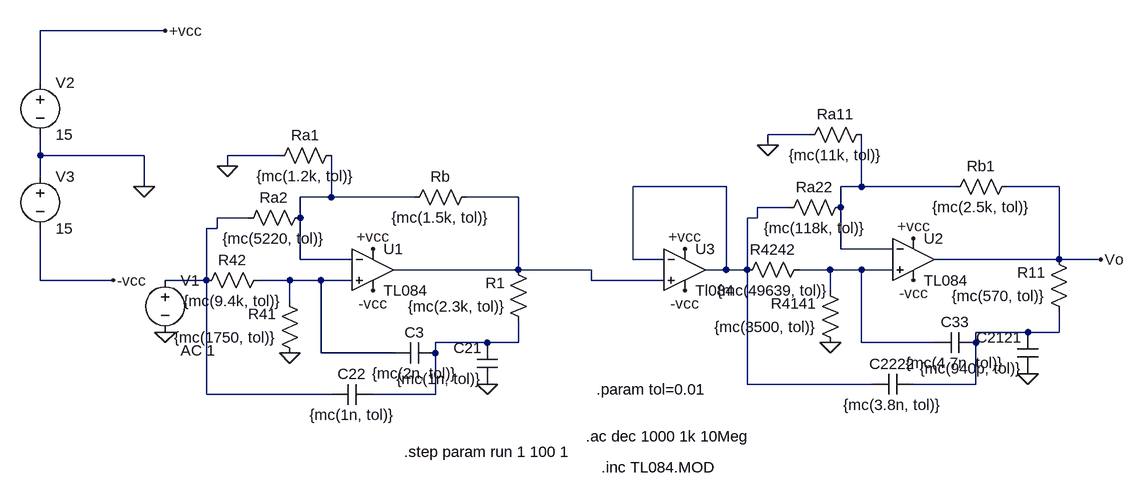
[diagram p0: schematic simIntento1.asc]
simIntento1.asc, the LTspice schematic file:
Version 4
SHEET 1 1392 680
WIRE -96 -208 -288 -208
WIRE -288 -128 -288 -208
WIRE 896 -48 832 -48
WIRE 832 -32 832 -48
WIRE -288 -16 -288 -48
WIRE -128 -16 -288 -16
WIRE 80 -16 0 -16
WIRE 0 0 0 -16
WIRE -288 16 -288 -16
WIRE -128 32 -128 -16
WIRE 768 32 624 32
WIRE 976 32 976 -48
WIRE 976 32 944 32
WIRE 1120 32 976 32
WIRE 1280 32 1200 32
WIRE 160 48 160 -16
WIRE 160 48 112 48
WIRE 288 48 160 48
WIRE 448 48 368 48
WIRE 864 64 816 64
WIRE 944 64 944 32
WIRE 32 80 -16 80
WIRE 112 80 112 48
WIRE 816 80 816 64
WIRE 816 80 800 80
WIRE -16 96 -16 80
WIRE -16 96 -32 96
WIRE 944 128 944 64
WIRE 1024 128 944 128
WIRE 112 144 112 80
WIRE 192 144 112 144
WIRE 624 144 624 32
WIRE 672 144 624 144
WIRE 1280 144 1280 32
WIRE 1280 144 1088 144
WIRE 1344 144 1280 144
WIRE 448 160 448 48
WIRE 448 160 256 160
WIRE 560 160 448 160
WIRE 768 160 768 32
WIRE 768 160 736 160
WIRE 800 160 800 80
WIRE 800 160 768 160
WIRE 928 160 880 160
WIRE 976 160 928 160
WIRE 1024 160 976 160
WIRE -288 176 -288 96
WIRE -176 176 -288 176
WIRE -32 176 -32 96
WIRE -32 176 -96 176
WIRE 96 176 48 176
WIRE 144 176 96 176
WIRE 192 176 144 176
WIRE 560 176 560 160
WIRE 672 176 560 176
WIRE 928 192 928 160
WIRE 96 208 96 176
WIRE 1232 256 1152 256
WIRE 1280 256 1280 224
WIRE 1280 256 1232 256
WIRE 400 272 320 272
WIRE 448 272 448 240
WIRE 448 272 400 272
WIRE 976 272 976 160
WIRE 1088 272 976 272
WIRE 1152 272 1152 256
WIRE 144 288 144 176
WIRE 256 288 144 288
WIRE 320 288 320 272
WIRE 800 336 800 160
WIRE 992 336 800 336
WIRE 1152 336 1152 272
WIRE 1152 336 1056 336
WIRE -32 352 -32 176
WIRE 160 352 -32 352
WIRE 320 352 320 288
WIRE 320 352 224 352
FLAG 224 128 +vcc
FLAG 224 192 -vcc
FLAG 400 336 0
FLAG 96 288 0
FLAG -96 256 0
FLAG 1056 112 +vcc
FLAG 1056 176 -vcc
FLAG 1232 320 0
FLAG 928 272 0
FLAG 1344 144 Vo
FLAG 704 128 +vcc
FLAG 704 192 -vcc
FLAG -128 32 0
FLAG -96 -208 +vcc
FLAG -176 176 -vcc
FLAG 832 -32 0
FLAG 0 0 0
SYMBOL res 128 64 R90
WINDOW 0 0 56 VBottom 2
WINDOW 3 32 56 VTop 2
SYMATTR InstName Ra2
SYMATTR Value {mc(5220, tol)}
SYMBOL res 384 32 R90
WINDOW 0 0 56 VBottom 2
WINDOW 3 32 56 VTop 2
SYMATTR InstName Rb
SYMATTR Value {mc(1.5k, tol)}
SYMBOL res 464 256 R180
WINDOW 0 36 76 Left 2
WINDOW 3 36 40 Left 2
SYMATTR InstName R1
SYMATTR Value {mc(2.3k, tol)}
SYMBOL res 112 304 R180
WINDOW 0 36 76 Left 2
WINDOW 3 36 40 Left 2
SYMATTR InstName R41
SYMATTR Value {mc(1750, tol)}
SYMBOL res -48 192 R270
WINDOW 0 32 56 VTop 2
WINDOW 3 0 56 VBottom 2
SYMATTR InstName R42
SYMATTR Value {mc(9.4k, tol)}
SYMBOL cap 320 272 R90
WINDOW 0 0 32 VBottom 2
WINDOW 3 32 32 VTop 2
SYMATTR InstName C3
SYMATTR Value {mc(2n, tol)}
SYMBOL cap 416 336 R180
WINDOW 0 24 56 Left 2
WINDOW 3 24 8 Left 2
SYMATTR InstName C21
SYMATTR Value {mc(1n, tol)}
SYMBOL cap 160 368 R270
WINDOW 0 32 32 VTop 2
WINDOW 3 0 32 VBottom 2
SYMATTR InstName C22
SYMATTR Value {mc(1n, tol)}
SYMBOL Opamps\\opamp2 224 96 R0
SYMATTR InstName U1
SYMATTR Value TL084
SYMBOL voltage -96 160 R0
WINDOW 123 24 124 Left 2
WINDOW 39 0 0 Left 2
WINDOW 3 24 44 Left 2
SYMATTR Value2 AC 1
SYMATTR InstName V1
SYMATTR Value ""
SYMBOL res 960 48 R90
WINDOW 0 0 56 VBottom 2
WINDOW 3 32 56 VTop 2
SYMATTR InstName Ra22
SYMATTR Value {mc(118k, tol)}
SYMBOL res 1216 16 R90
WINDOW 0 0 56 VBottom 2
WINDOW 3 32 56 VTop 2
SYMATTR InstName Rb1
SYMATTR Value {mc(2.5k, tol)}
SYMBOL res 1296 240 R180
WINDOW 0 36 76 Left 2
WINDOW 3 36 40 Left 2
SYMATTR InstName R11
SYMATTR Value {mc(570, tol)}
SYMBOL res 944 288 R180
WINDOW 0 36 76 Left 2
WINDOW 3 36 40 Left 2
SYMATTR InstName R4141
SYMATTR Value {mc(3500, tol)}
SYMBOL res 784 176 R270
WINDOW 0 32 56 VTop 2
WINDOW 3 0 56 VBottom 2
SYMATTR InstName R4242
SYMATTR Value {mc(49639, tol)}
SYMBOL cap 1152 256 R90
WINDOW 0 0 32 VBottom 2
WINDOW 3 32 32 VTop 2
SYMATTR InstName C33
SYMATTR Value {mc(4.7n, tol)}
SYMBOL cap 1248 320 R180
WINDOW 0 24 56 Left 2
WINDOW 3 24 8 Left 2
SYMATTR InstName C2121
SYMATTR Value {mc(940p, tol)}
SYMBOL cap 992 352 R270
WINDOW 0 32 32 VTop 2
WINDOW 3 0 32 VBottom 2
SYMATTR InstName C2222
SYMATTR Value {mc(3.8n, tol)}
SYMBOL Opamps\\opamp2 1056 80 R0
SYMATTR InstName U2
SYMATTR Value TL084
SYMBOL Opamps\\opamp2 704 96 R0
SYMATTR InstName U3
SYMATTR Value Tl084
SYMBOL voltage -288 -144 R0
SYMATTR InstName V2
SYMATTR Value 15
SYMBOL voltage -288 0 R0
SYMATTR InstName V3
SYMATTR Value 15
SYMBOL res 176 -32 R90
WINDOW 0 0 56 VBottom 2
WINDOW 3 32 56 VTop 2
SYMATTR InstName Ra1
SYMATTR Value {mc(1.2k, tol)}
SYMBOL res 992 -64 R90
WINDOW 0 0 56 VBottom 2
WINDOW 3 32 56 VTop 2
SYMATTR InstName Ra11
SYMATTR Value {mc(11k, tol)}
TEXT 576 464 Left 2 !.inc TL084.MOD
TEXT 552 416 Left 2 !.ac dec 1000 1k 10Meg
TEXT 568 344 Left 2 !.param tol=0.01
TEXT 272 440 Left 2 !.step param run 1 100 1

The netlist it stands for:
* simIntento1.asc
Ra2 N003 N005 {mc(5220, tol)}
Rb N004 N003 {mc(1.5k, tol)}
R1 N009 N004 {mc(2.3k, tol)}
R41 0 N007 {mc(1750, tol)}
R42 N005 N007 {mc(9.4k, tol)}
C3 N009 N007 {mc(2n, tol)}
C21 0 N009 {mc(1n, tol)}
C22 N005 N009 {mc(1n, tol)}
XU1 N007 N003 +vcc -vcc N004 TL084  ; pins In+ In- V+ V- OUT
V1 N005 0 AC 1
Ra22 N002 N001 {mc(118k, tol)}
Rb1 Vo N002 {mc(2.5k, tol)}
R11 N008 Vo {mc(570, tol)}
R4141 0 N006 {mc(3500, tol)}
R4242 N001 N006 {mc(49639, tol)}
C33 N008 N006 {mc(4.7n, tol)}
C2121 0 N008 {mc(940p, tol)}
C2222 N001 N008 {mc(3.8n, tol)}
XU2 N006 N002 +vcc -vcc Vo TL084  ; pins In+ In- V+ V- OUT
XU3 N004 N001 +vcc -vcc N001 Tl084  ; pins In+ In- V+ V- OUT
V2 +vcc 0 15
V3 0 -vcc 15
Ra1 N003 0 {mc(1.2k, tol)}
Ra11 N002 0 {mc(11k, tol)}
.inc TL084.MOD
.ac dec 1000 1k 10Meg
.param tol=0.01
.step param run 1 100 1
.backanno
.end